# EAGLE design adapter_v4.0 (EAGLE 6.6.0)
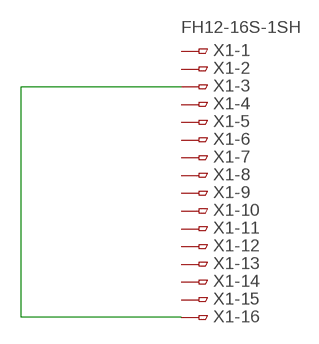
[diagram p0: schematic, sheet 1]

## Parts
X1  FH12-16S-1SH  [FH12-16S-1SH]

## Nets
N$1: X1.3 X1.16
Unconnected: X1.1 X1.2 X1.4 X1.5 X1.6 X1.7 X1.8 X1.9 X1.10 X1.11 X1.12 X1.13 X1.14 X1.15

## Library data of the parts
X1 = con-hirose:FH12-16S-1S: 1mm Pitch Connectors For FPC/FFC Source: Data sheet <http://www.hirose.co.jp/cataloge_hp/e58605370.pdf>; OC_FARNELL: unknown; OC_NEWARK: unknown

## Board
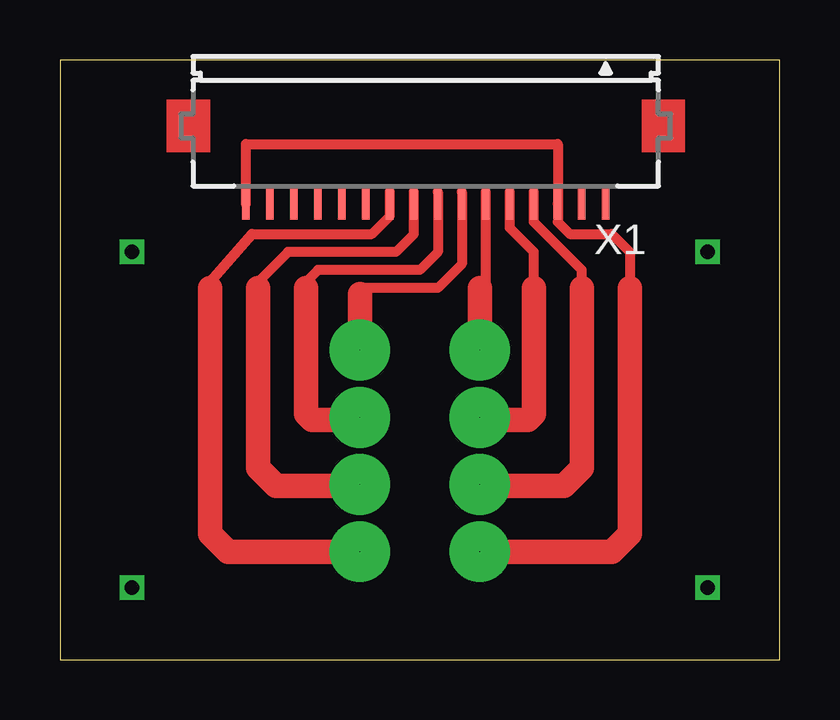
[diagram p1: board, top side]

Size 30 x 25 mm. Coordinates in mm from the lower left corner, seen from the top.
Outline: 0,0 30,0 30,25 0,25 0,0
Copper layers (1*16): Top 0.035mm / dielectric 1.5mm / Bottom 0.035mm
Design rules "default": minimum track width 10mil, minimum drill 24mil, track to track 8mil, track to pad 8mil, pad to pad 8mil, via to via 8mil, smd to smd 8mil, copper to edge 40mil, drill to drill 8mil, minimum pad ring 10mil, minimum via ring 8mil, stop-mask expansion 4mil, vias tented up to drill 0mil, thermal gap 10mil

### Footprints (pad centres in the part's own frame; a part is rotated, then mirrored left to right if it is on the bottom)
FH12-16S-1SH = smd 0.3 x 1.3: 1 -7.5,3.25; 2 -6.5,3.25; 3 -5.5,3.25; 4 -4.5,3.25; 5 -3.5,3.25; 6 -2.5,3.25; 7 -1.5,3.25; 8 -0.5,3.25; 9 0.5,3.25; 10 1.5,3.25; 11 2.5,3.25; 12 3.5,3.25; 13 4.5,3.25; 14 5.5,3.25; 15 6.5,3.25; 16 7.5,3.25

### Placement (x,y rotation side)
X1  15.25,22.25 180 top

### Tracks (layer width: path | path; a pad name or v marks a point on that pad's centre or on a via)
N$1
  Top 0.406: 23.75,15.5 23.75,17 23,17.75 21.25,17.75 20.75,18.25 X1.3 20.75,21.5 7.75,21.5 X1.16
  Top 1.016: 23.75,15.5 23.75,5.25 23,4.5 17.5,4.5
N$2
  Top 0.406: 19.75,15.75 19.75,17 18.75,18 18.75,19.5
N$3
  Top 0.406: 17.5,15.75 17.75,15.75 17.75,19.5
N$4
  Top 0.406: 16.75,19.5 16.75,16.5 15.75,15.5 12.5,15.5
N$5
  Top 0.406: 15.75,19.5 15.75,17 15,16.25 10.75,16.25 10.25,15.75
N$6
  Top 0.406: 8.25,15.75 9.5,17 14,17 14.75,17.75 14.75,19.5
N$7
  Top 0.406: 6,15.5 6.25,15.75 8,17.75 13,17.75 13.75,18.5 13.75,19.5
S$24  (via drill 0.6)
  other vias: 3,3
S$25  (via drill 0.6)
  other vias: 3,17
S$26  (via drill 0.6)
  other vias: 27,17
S$27  (via drill 0.6)
  other vias: 27,3
S$28
  Top 1.016: 12.5,14.5 12.5,13.2
S$29
  Top 1.016: 17.5,13.1 17.5,15.5
S$30  (via drill 0 pad 2.54)
  other vias: 12.5,12.9
S$31  (via drill 0 pad 2.54)
  other vias: 17.5,12.9
S$32  (via drill 0 pad 2.54)
  other vias: 12.5,10.1
S$33  (via drill 0 pad 2.54)
  other vias: 17.5,10.1
S$34  (via drill 0 pad 2.54)
  other vias: 12.5,7.3
S$35  (via drill 0 pad 2.54)
  other vias: 17.5,7.3
S$36  (via drill 0 pad 2.54)
  other vias: 17.5,4.5
S$37
  Top 1.016: 10.25,14.5 10.25,10.25 10.5,10 12.5,10
S$38
  Top 1.016: 8.25,14.5 8.25,8 9,7.25 12.5,7.25
S$39  (via drill 0 pad 2.54)
  Top 1.016: 6.25,15.5 6.25,5.25 7,4.5 v12.5,4.5
S$40
  Top 1.016: 19.75,15.5 19.75,10.25 19.5,10 17.5,10
S$41
  Top 0.406: 21.75,15.5 21.75,16.25 19.75,18.25 19.75,19.5
  Top 1.016: 21.75,15.5 21.75,8 21,7.25 17.5,7.25
S$43
  Top 1.016: 8.25,14.5 8.25,15.5
S$44
  Top 1.016: 10.25,14.5 10.25,15.5
S$45
  Top 1.016: 12.5,14.5 12.5,15.25